# Altium schematic sheet 01-Title_Page.SchDoc
size A; SheetNumber: 1; SheetTotal: 8
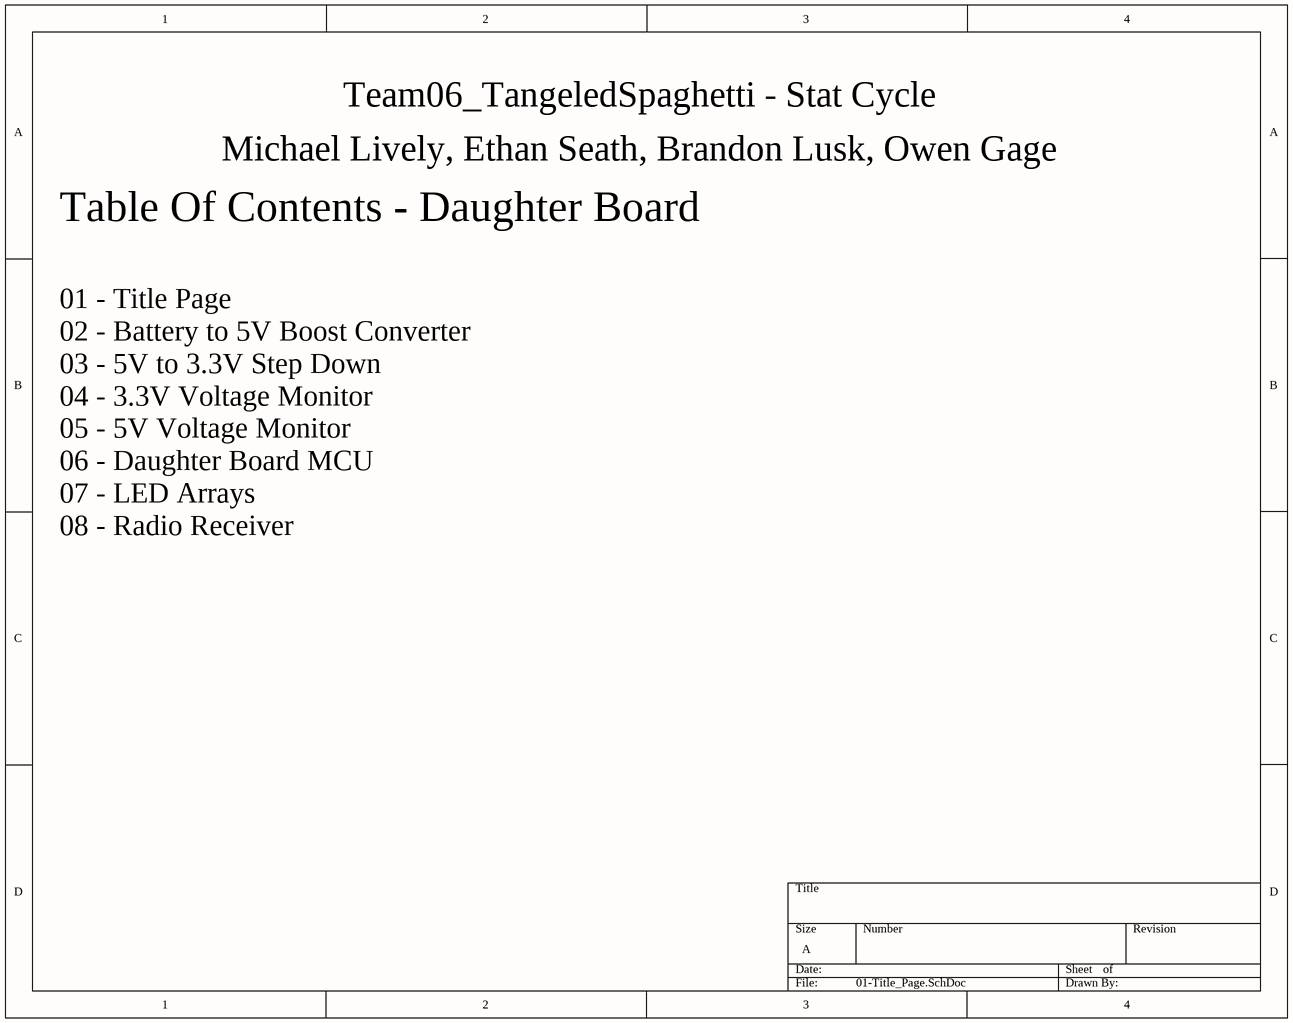
[diagram p0: 01-Title_Page.SchDoc]

## Notes on the sheet
- Team06_TangeledSpaghetti - Stat Cycle
- Michael Lively, Ethan Seath, Brandon Lusk, Owen Gage
- Table Of Contents - Daughter Board
- 01 - Title Page
  02 - Battery to 5V Boost Converter
  03 - 5V to 3.3V Step Down
  04 - 3.3V Voltage Monitor
  05 - 5V Voltage Monitor
  06 - Daughter Board MCU
  07 - LED Arrays
  08 - Radio Receiver